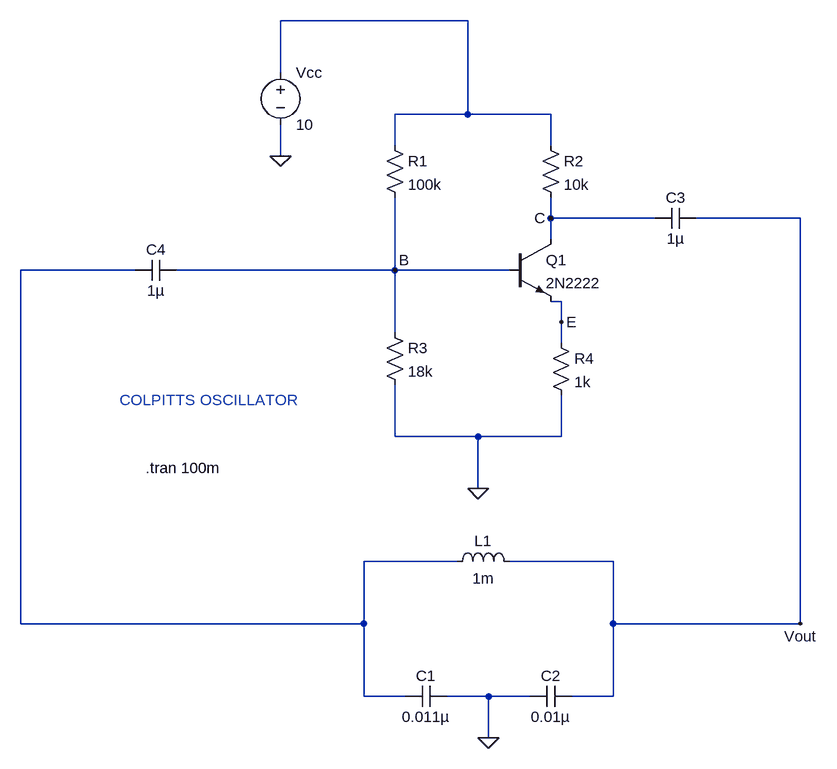
[diagram p0: schematic final_circuit.asc]
final_circuit.asc, the LTspice schematic file:
Version 4
SHEET 1 1252 1192
WIRE 304 -64 16 -64
WIRE 16 16 16 -64
WIRE 304 80 304 -64
WIRE 304 80 192 80
WIRE 432 80 304 80
WIRE 192 128 192 80
WIRE 432 128 432 80
WIRE 16 144 16 96
WIRE 432 240 432 208
WIRE 592 240 432 240
WIRE 816 240 656 240
WIRE 432 272 432 240
WIRE -208 320 -384 320
WIRE 192 320 192 208
WIRE 192 320 -144 320
WIRE 368 320 192 320
WIRE 448 368 432 368
WIRE 448 400 448 368
WIRE 192 416 192 320
WIRE 448 432 448 400
WIRE 192 576 192 496
WIRE 320 576 192 576
WIRE 448 576 448 512
WIRE 448 576 320 576
WIRE 320 656 320 576
WIRE 288 768 144 768
WIRE 528 768 368 768
WIRE -384 864 -384 320
WIRE 144 864 144 768
WIRE 144 864 -384 864
WIRE 528 864 528 768
WIRE 816 864 816 240
WIRE 816 864 528 864
WIRE 144 976 144 864
WIRE 208 976 144 976
WIRE 336 976 272 976
WIRE 400 976 336 976
WIRE 528 976 528 864
WIRE 528 976 464 976
WIRE 336 1040 336 976
FLAG 320 656 0
FLAG 16 144 0
FLAG 816 864 Vout
FLAG 192 320 B
FLAG 432 240 C
FLAG 448 400 E
FLAG 336 1040 0
SYMBOL res 176 112 R0
SYMATTR InstName R1
SYMATTR Value 100k
SYMBOL res 416 112 R0
SYMATTR InstName R2
SYMATTR Value 10k
SYMBOL res 176 400 R0
SYMATTR InstName R3
SYMATTR Value 18k
SYMBOL res 432 416 R0
SYMATTR InstName R4
SYMATTR Value 1k
SYMBOL npn 368 272 R0
SYMATTR InstName Q1
SYMATTR Value 2N2222
SYMBOL cap 208 992 R270
WINDOW 0 32 32 VTop 2
WINDOW 3 0 32 VBottom 2
SYMATTR InstName C1
SYMATTR Value 0.011µ
SYMBOL cap 400 992 R270
WINDOW 0 32 32 VTop 2
WINDOW 3 0 32 VBottom 2
SYMATTR InstName C2
SYMATTR Value 0.01µ
SYMBOL cap 656 224 R90
WINDOW 0 0 32 VBottom 2
WINDOW 3 32 32 VTop 2
SYMATTR InstName C3
SYMATTR Value 1µ
SYMBOL cap -144 304 R90
WINDOW 0 0 32 VBottom 2
WINDOW 3 32 32 VTop 2
SYMATTR InstName C4
SYMATTR Value 1µ
SYMBOL ind 272 784 R270
WINDOW 0 32 56 VTop 2
WINDOW 3 5 56 VBottom 2
SYMATTR InstName L1
SYMATTR Value 1m
SYMBOL voltage 16 0 R0
SYMATTR InstName Vcc
SYMATTR Value 10
TEXT -232 520 Left 2 ;COLPITTS OSCILLATOR
TEXT -192 624 Left 2 !.tran 100m

The netlist it stands for:
* final_circuit.asc
R1 N001 B 100k
R2 N001 C 10k
R3 B 0 18k
R4 E 0 1k
Q1 C B E 0 2N2222
C1 N002 0 0.011µ
C2 0 Vout 0.01µ
C3 Vout C 1µ
C4 B N002 1µ
L1 N002 Vout 1m
Vcc N001 0 10
.model NPN NPN
.model PNP PNP
.lib standard.bjt
* COLPITTS OSCILLATOR
.tran 100m
.backanno
.end